# Altium schematic sheet Power Conversion.SchDoc
size A4; SheetNumber: 2; SheetTotal: 4
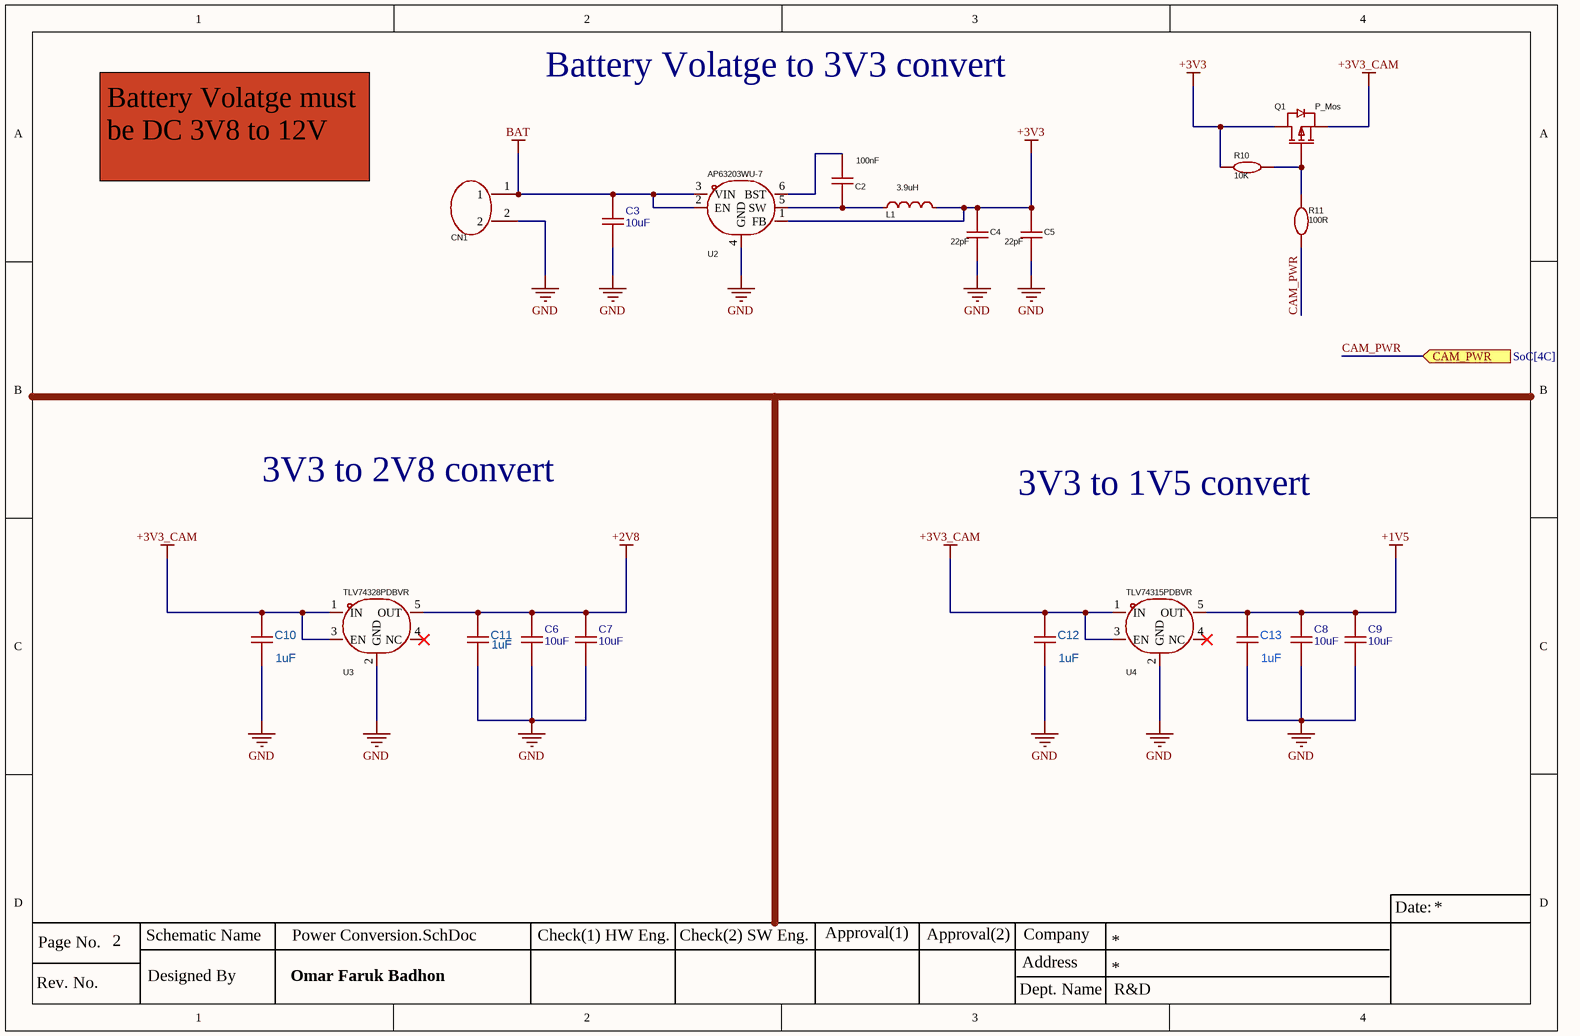
[diagram p0: Power Conversion.SchDoc]

## Parts
C2  100nF  [100nF SMD Ceramic 201]
C3  10uF  [10uF SMD Ceramic 603]
C4  22pF  [22pF SMD Ceramic 603]
C5  22pF  [22pF SMD Ceramic 603]
C6  10uF  [10uF SMD Ceramic 603]
C7  10uF  [10uF SMD Ceramic 603]
C8  10uF  [10uF SMD Ceramic 603]
C9  10uF  [10uF SMD Ceramic 603]
C10  1uF  [1uF Cap]
C11  1uF  [1uF Cap]
C12  1uF  [1uF Cap]
C13  1uF  [1uF Cap]
CN1  B2B-PH-K-S(LF)(SN)  [Connector 2P]  (value not drawn)
L1  3.9uH  [3.9uH power Inductor]
Q1  P_Mos  [P channel msfet (AO3401A1)]
R10  10K  [10K SMD Ceramic 201]
R11  100R  [100R 402]
U2  AP63203WU-7  [3V3 Converter (AP63203)]
U3  TLV74328PDBVR  [2V8 Converter (TLV74328)]
U4  TLV74315PDBVR  [1V5 Converter (TLV74215)]

## Ports
CAM_PWR (in, see SoC[4C])

## Nets
+1V5: C8.2 C9.2 C13.2 U4.5(OUT)
+2V8: C6.2 C7.2 C11.2 U3.5(OUT)
+3V3: C4.2 C5.2 L1.2 Q1.3(D) R10.1 U2.1(FB)
+3V3_CAM: C10.2 C12.2 Q1.2(S) U3.1(IN) U3.3(EN) U4.1(IN) U4.3(EN)
BAT: C3.2 CN1.1 U2.2(EN) U2.3(VIN)
GND: C3.1 C4.1 C5.1 C6.1 C7.1 C8.1 C9.1 C10.1 C11.1 C12.1 C13.1 CN1.2 U2.4(GND) U3.2(GND) U4.2(GND)
CAM_PWR: R11.1 ; port CAM_PWR
NetC2_1: C2.1 L1.1 U2.5(SW)
NetC2_2: C2.2 U2.6(BST)
NetQ1_1: Q1.1(G) R10.2 R11.2

Not connected (* = marked no-connect by the designer): U3 4(NC)*; U4 4(NC)*

## Notes on the sheet
- Battery Volatge to 3V3 convert
- Battery Volatge must be DC 3V8 to 12V
- 3V3 to 2V8 convert
- 3V3 to 1V5 convert
- Date:
- Rev. No.
- Page No.
- Schematic Name
- Designed By
- Omar Faruk Badhon
- Check(1) HW Eng.
- Check(2) SW Eng.
- Approval(1)
- Approval(2)
- Address
- Company
- Dept. Name
- R&D

## Library data of the parts
C2 = 100nF SMD Ceramic 201: 10V 100nF X5R ±10% 0201 Multilayer Ceramic Capacitors MLCC - SMD/SMT ROHS; Manufacturer: muRata(村田); Symbol: GRM033R61A104KE84D; Add into BOM: yes; Device: GRM033R61A104KE84D; LCSC Part Name: 100nF ±10% 10V; Supplier Part: C161466; Manufacturer Part: GRM033R61A104KE84D; Supplier Footprint: 0201; JLCPCB Part Class: Extended Part; Datasheet: https://atta.szlcsc.com/upload/public/pdf/source/20181011/C161466_67687620A192BB2B75972275444AF1E7.pdf; Supplier: LCSC; Convert to PCB: yes; Value: 100nF; Tolerance: ±10%
C3 C6-C9 = 10uF SMD Ceramic 603: 10V 10uF B ±10% 0603 Multilayer Ceramic Capacitors MLCC - SMD/SMT ROHS; Manufacturer: muRata(村田); Manufacturer Part: GRM188B31A106KE69D; nameAlias: Value; Contributor: LCSC; Supplier: LCSC; Supplier Part: C469532; JLCPCB Part Class: Extended Part; spicePre: C; spiceSymbolName: GRM188B31A106KE69D
C4 C5 = 22pF SMD Ceramic 603: 16V 22pF C0G ±5% 0603 Multilayer Ceramic Capacitors MLCC - SMD/SMT ROHS; Manufacturer: KEMET(基美); Symbol: C0603C220J4GAC7867; Add into BOM: yes; Device: C0603C220J4GAC7867; LCSC Part Name: 22pF ±5% 16V; Supplier Part: C561800; Manufacturer Part: C0603C220J4GAC7867; Supplier Footprint: 0603; JLCPCB Part Class: Extended Part; Datasheet: https://atta.szlcsc.com/upload/public/pdf/source/20200618/C561800_1756A88345AB30E1FCE50DFDDC46141D.pdf; Supplier: LCSC; Convert to PCB: yes; Value: 22pF; Tolerance: ±5%
C10-C13 = 1uF Ceramic SMD 603: 16V 1uF Y5V -20%~+80% 0603 Multilayer Ceramic Capacitors MLCC - SMD/SMT ROHS; Manufacturer: SAMWHA(三和); Symbol: CS1608Y5V105Z160NRB; Add into BOM: yes; Device: CS1608Y5V105Z160NRB; LCSC Part Name: 1uF -20%~+80% 16V; Supplier Part: C5189821; Manufacturer Part: CS1608Y5V105Z160NRB; Supplier Footprint: 0603; JLCPCB Part Class: Extended Part; Datasheet: https://atta.szlcsc.com/upload/public/pdf/source/20221012/139B9393213A50C271C48844AD3DF211.pdf; Supplier: LCSC; Convert to PCB: yes; Value: 1uF; Tolerance: -20%~+80%
CN1 = Connector 2P: 1x2P 2P PH Tin 2 -25℃~+85℃ 2A 1 2mm Brass Direct Insert Plugin,P=2mm Wire To Board Connector ROHS; Manufacturer: JST; Add into BOM: yes; Number of PINs Per Row: 2; Rated Voltage (Max): 100V; Plastic Material: PA66; Flame Retardant Rating: UL94V-0; Supplementary Features: K-leg punch; Z-Height of the Board: 6mm; X-Length of Bottom Edge on Board (Spacing Line): 5.9mm; Y-Width of Bottom Edge on Board: 4.5mm; Symbol: B2B-PH-K-S(LF)(SN); Device: B2B-PH-K-S(LF)(SN); LCSC Part Name: 1x2P 间距:2mm 直插 系列:PH; Supplier Part: C131337; Manufacturer Part: B2B-PH-K-S(LF)(SN); Supplier Footprint: 插件,P=2mm; JLCPCB Part Class: Extended Part; Datasheet: https://atta.szlcsc.com/upload/public/pdf/source/20171026/C131342_15089839687311058815.pdf; Supplier: LCSC; Convert to PCB: yes; Pins Structure: 1x2P; Pitch: 2mm; Mounting Style: Direct Insert; Reference Series: PH; Number of Pins: 2P; Number of Rows: 1; Row Spacing: -; Current Rating (Max): 2A; Contact Material: Brass; Contact Plating: Tin; Operating Temperature Range: -25℃~+85℃; Colour: White
L1 = 3.9uH SMD PI: 1.5A 3.9uH ±20% 1.4A SMD,3x3mm Power Inductors ROHS; Manufacturer: cjiang(长江微电); Symbol: FNR3015S3R9MT; Add into BOM: yes; DC Resistance (DCR): 137mΩ; Device: FNR3015S3R9MT; LCSC Part Name: 3.9uH ±20% 1.4A; Supplier Part: C167751; Manufacturer Part: FNR3015S3R9MT; Supplier Footprint: SMD,3x3mm; JLCPCB Part Class: Extended Part; Datasheet: https://atta.szlcsc.com/upload/public/pdf/source/20190327/C167925_9EFF0AABC4CA629C2CC95961DBF7D39D.pdf; Supplier: LCSC; Convert to PCB: yes; Value: 3.9uH; Tolerance: ±20%; Saturation Current (Isat): 1.4A
Q1 = P channel msfet (AO3401A1): 30V 4A 44mΩ@10V,4.3A 1.4W 1.3V@250uA 1 Piece P-Channel SOT-23 MOSFETs ROHS; Manufacturer: AOS; Device: AO3401A_C15127; Add into BOM: yes; Type: 1个PChannel; Total Gate Charge (Qg@Vgs): 12.2nC@4.5V; Input Capacitance (Ciss@Vds): 1.2nF@15V; Symbol: AO3401A; LCSC Part Name: 1个P沟道 耐压:30V 电流:4A; Supplier Part: C15127; Manufacturer Part: AO3401A; Supplier Footprint: SOT-23; JLCPCB Part Class: Basic Part; Datasheet: https://atta.szlcsc.com/upload/public/pdf/source/20160507/1462613609053.pdf; Supplier: LCSC; Convert to PCB: yes; Drain Source On Resistance (RDS(on)@Vgs,Id): 44mΩ@10V,4.3A; Gate Threshold Voltage (Vgs(th)@Id): 1.3V@250uA; Operating Temperature: -55℃~+150℃@(Tj)
R10 = 10K SMD Ceramic 201: 50mW Thick Film Resistors 25V ±1% ±200ppm/℃ 10kΩ 0201 Chip Resistor - Surface Mount ROHS; Manufacturer: YAGEO(国巨); Symbol: AF0201FR-0710KL; Add into BOM: yes; Device: AF0201FR-0710KL; LCSC Part Name: 厚膜电阻 10kΩ ±1% 50mW; Supplier Part: C143978; Manufacturer Part: AF0201FR-0710KL; Supplier Footprint: 0201; JLCPCB Part Class: Extended Part; Datasheet: https://atta.szlcsc.com/upload/public/pdf/source/20180927/C229861_4ABDC471507C1ED6AFB4BA66AFC8620A.pdf; Supplier: LCSC; Convert to PCB: yes; Type: Thick Film Resistors; Value: 10kΩ; Tolerance: ±1%; Temperature Coefficient: ±200ppm/℃; Operating Temperature Range: -55℃~+125℃
R11 = 100R 402: 100mW Thick Film Resistors ±100ppm/℃ ±1% 100Ω 0402 Chip Resistor - Surface Mount ROHS; Manufacturer: PANASONIC(松下); Symbol: ERJ2RKF1000X; Add into BOM: yes; Device: ERJ2RKF1000X; LCSC Part Name: 100Ω ±1% 100mW 厚膜电阻; Supplier Part: C413063; Manufacturer Part: ERJ2RKF1000X; Supplier Footprint: 0402; JLCPCB Part Class: Extended Part; Datasheet: https://atta.szlcsc.com/upload/public/pdf/source/20190820/C413063_95D61CC78C57CA6EC5636452389D6E3B.pdf; Supplier: LCSC; Convert to PCB: yes; Type: Thick Film Resistors; Value: 100Ω; Tolerance: ±1%; Overload Voltage (Max): -; Temperature Coefficient: ±100ppm/℃; Operating Temperature Range: -55℃~+155℃
U2 = AP63203: Step-down type Fixed 2A 3.3V 3.8V~32V TSOT-23-6 DC-DC Converters ROHS; Manufacturer: DIODES(美台); Add into BOM: yes; Switching Frequency: 1.1MHz; Number of Outputs: 1; Switch tube (built-in/external): 内置; Symbol: AP63203WU-7; Device: AP63203WU-7; LCSC Part Name: AP63203WU-7; Supplier Part: C780769; Manufacturer Part: AP63203WU-7; Supplier Footprint: TSOT-23-6; JLCPCB Part Class: Extended Part; Datasheet: https://atta.szlcsc.com/upload/public/pdf/source/20210622/C780769_099C67289BD3EC61AAFB52D8B07125B3.pdf; Supplier: LCSC; Convert to PCB: yes; Function: Step-down type; Output Type: Fixed; Input Voltage: 3.8V~32V; Output Voltage: 3.3V; Output Current (Max): 2A; Operating Temperature: -40℃~+85℃@(TA); Synchronous Rectification: Yes; Topology: Step-down
U3 = TLV74328: 300mA 68dB Fixed 2.8V Positive electrode 5.5V SOT-23-5 Voltage Regulators - Linear, Low Drop Out (LDO) Regulators ROHS; Manufacturer: TI(德州仪器); Add into BOM: yes; Dropout Voltage: 290mV@(300mA); standby current: 60uA; Number of Outputs: 1; Symbol: TLV74328PDBVR; Device: TLV74328PDBVR; LCSC Part Name: 具有使能功能的 300mA、低 IQ、低压降稳压器; Supplier Part: C408971; Manufacturer Part: TLV74328PDBVR; Supplier Footprint: SOT-23-5; JLCPCB Part Class: Extended Part; Datasheet: https://www.ti.com/cn/lit/gpn/tlv743p; Supplier: LCSC; Convert to PCB: yes; Output Type: Fixed; Maximum Input Voltage: 5.5V; Output Voltage: 2.8V; Output Current: 300mA; Power Supply Rejection Ratio (PSRR): 68dB; Feature: 防静电保护；低ESR；Thermal Protection(TSD)；欠压闭锁；Overcurrent Protection(OCP)；带使能; Operating Temperature: -40℃~+125℃@(Tj); Output Polarity: Positive electrode
U4 = TLV74315: 300mA Fixed 1.5V Positive electrode 5.5V SOT-23-5 Voltage Regulators - Linear, Low Drop Out (LDO) Regulators ROHS; Manufacturer: TI(德州仪器); Add into BOM: yes; Dropout Voltage: 400mV@(300mA); standby current: 60uA; Number of Outputs: 1; Symbol: TLV74315PDBVR; Device: TLV74315PDBVR; LCSC Part Name: 具有使能功能的 300mA、低 IQ、低压降稳压器; Supplier Part: C469895; Manufacturer Part: TLV74315PDBVR; Supplier Footprint: SOT-23-5; JLCPCB Part Class: Extended Part; Datasheet: https://www.ti.com/cn/lit/gpn/tlv743p; Supplier: LCSC; Convert to PCB: yes; Output Type: Fixed; Maximum Input Voltage: 5.5V; Output Voltage: 1.5V; Output Current: 300mA; Feature: 防静电保护；Short-Circuit  Protection；低ESR；Thermal Protection(TSD)；欠压闭锁；Overcurrent Protection(OCP)；带使能; Operating Temperature: -40℃~+125℃@(Tj); Output Polarity: Positive electrode